# EAGLE schematic contra1579 (EAGLE 7.5.0)
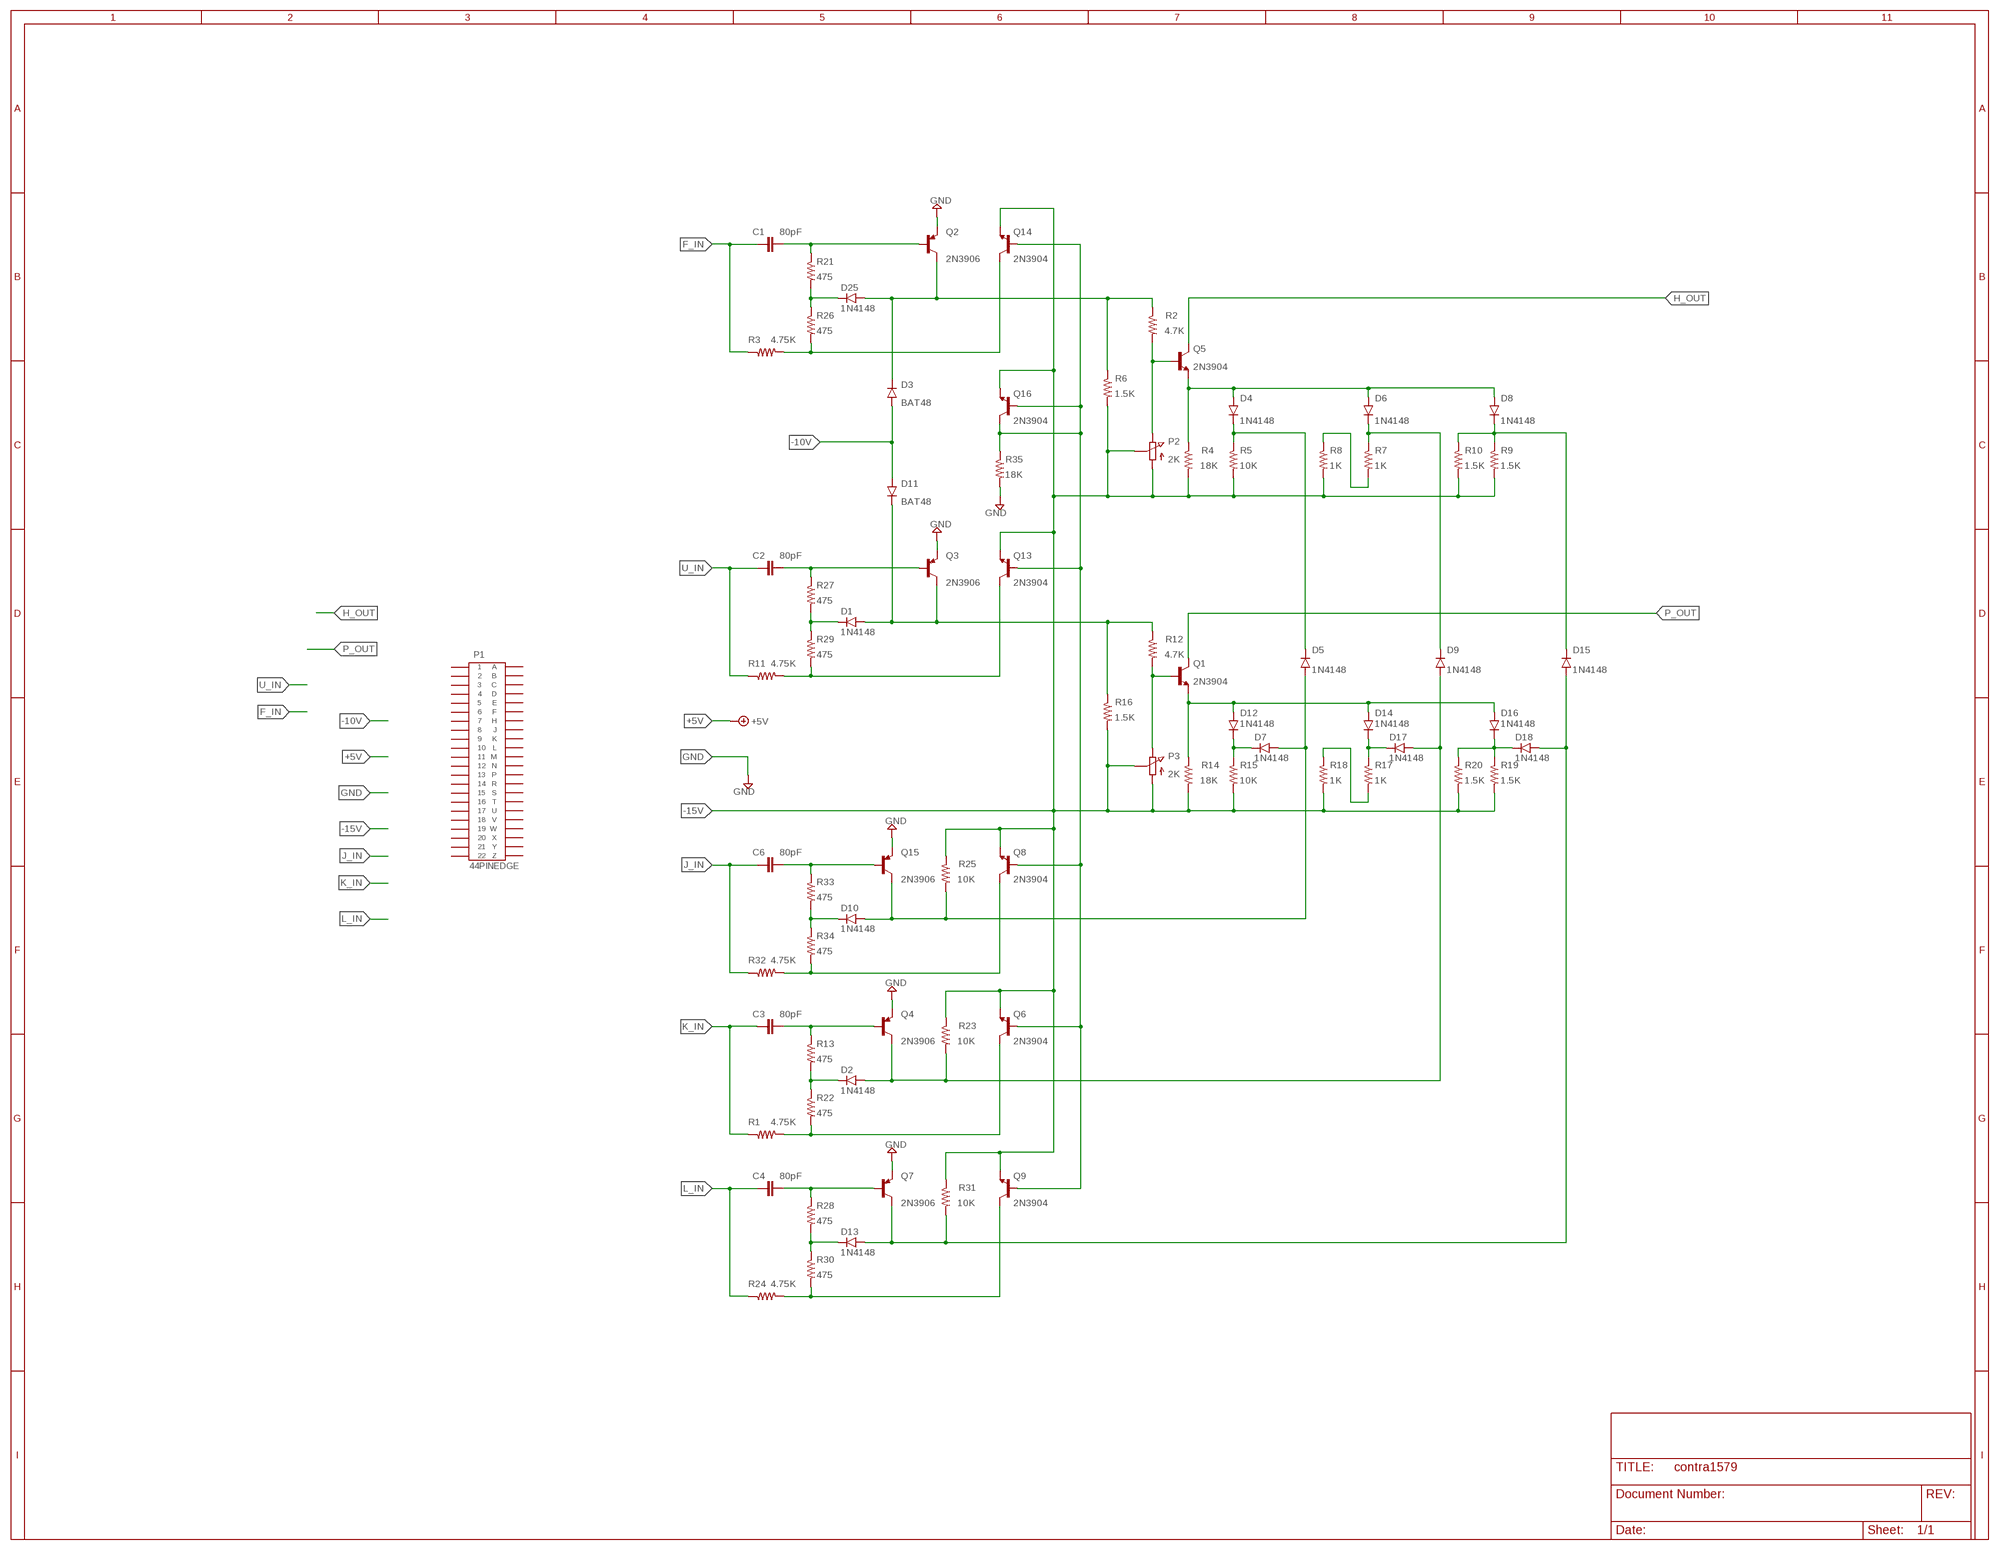
[diagram p0: schematic, sheet 1]

## Parts
C1  80pF  CAP1000PF  [5MM_TH]
C2  80pF  CAP1000PF  [5MM_TH]
C3  80pF  CAP1000PF  [5MM_TH]
C4  80pF  CAP1000PF  [5MM_TH]
C6  80pF  CAP1000PF  [5MM_TH]
D1  1N4148  [DO35-7]
D2  1N4148  [DO35-7]
D3  BAT48  1N4148  [DO35-7]
D4  1N4148  [DO35-7]
D5  1N4148  [DO35-7]
D6  1N4148  [DO35-7]
D7  1N4148  [DO35-7]
D8  1N4148  [DO35-7]
D9  1N4148  [DO35-7]
D10  1N4148  [DO35-7]
D11  BAT48  1N4148  [DO35-7]
D12  1N4148  [DO35-7]
D13  1N4148  [DO35-7]
D14  1N4148  [DO35-7]
D15  1N4148  [DO35-7]
D16  1N4148  [DO35-7]
D17  1N4148  [DO35-7]
D18  1N4148  [DO35-7]
D25  1N4148  [DO35-7]
P1  44PINEDGE  [44PINEDGE]
P2  2K  POT-3006P  [3006P]
P3  2K  POT-3006P  [3006P]
Q1  2N3904  [TO92]
Q2  2N3906  [TO92]
Q3  2N3906  [TO92]
Q4  2N3906  [TO92]
Q5  2N3904  [TO92]
Q6  2N3904  [TO92]
Q7  2N3906  [TO92]
Q8  2N3904  [TO92]
Q9  2N3904  [TO92]
Q13  2N3904  [TO92]
Q14  2N3904  [TO92]
Q15  2N3906  [TO92]
Q16  2N3904  [TO92]
R1  4.75K  R-1/4WATT  [0207/10]
R2  4.7K  R-1/4WATT  [0207/10]
R3  4.75K  R-1/4WATT  [0207/10]
R4  18K  R-1/4WATT  [0207/10]
R5  10K  R-1/4WATT  [0207/10]
R6  1.5K  R-1/4WATT  [0207/10]
R7  1K  R-1/4WATT  [0207/10]
R8  1K  R-1/4WATT  [0207/10]
R9  1.5K  R-1/4WATT  [0207/10]
R10  1.5K  R-1/4WATT  [0207/10]
R11  4.75K  R-1/4WATT  [0207/10]
R12  4.7K  R-1/4WATT  [0207/10]
R13  475  R-1/4WATT  [0207/10]
R14  18K  R-1/4WATT  [0207/10]
R15  10K  R-1/4WATT  [0207/10]
R16  1.5K  R-1/4WATT  [0207/10]
R17  1K  R-1/4WATT  [0207/10]
R18  1K  R-1/4WATT  [0207/10]
R19  1.5K  R-1/4WATT  [0207/10]
R20  1.5K  R-1/4WATT  [0207/10]
R21  475  R-1/4WATT  [0207/10]
R22  475  R-1/4WATT  [0207/10]
R23  10K  R-1/4WATT  [0207/10]
R24  4.75K  R-1/4WATT  [0207/10]
R25  10K  R-1/4WATT  [0207/10]
R26  475  R-1/4WATT  [0207/10]
R27  475  R-1/4WATT  [0207/10]
R28  475  R-1/4WATT  [0207/10]
R29  475  R-1/4WATT  [0207/10]
R30  475  R-1/4WATT  [0207/10]
R31  10K  R-1/4WATT  [0207/10]
R32  4.75K  R-1/4WATT  [0207/10]
R33  475  R-1/4WATT  [0207/10]
R34  475  R-1/4WATT  [0207/10]
R35  18K  R-1/4WATT  [0207/10]

## Nets
-10V: D3.A D11.A
-15V: P2.1(A) P2.2(S) P3.1(A) P3.2(S) Q6.3(E) Q8.3(E) Q9.3(E) Q13.3(E) Q14.3(E) Q16.3(E) R4.2 R5.2 R6.2 R8.2 R9.2 R10.2 R14.2 R15.2 R16.2 R18.2 R19.2 R20.2 R23.1 R25.1 R31.1
F_IN: C1.1 R3.1
GND: Q2.3(E) Q3.3(E) Q4.3(E) Q7.3(E) Q15.3(E) R35.2
H_OUT: Q5.1(C)
J_IN: C6.1 R32.1
K_IN: C3.1 R1.1
L_IN: C4.1 R24.1
N$1: C1.2 Q2.2(B) R21.1
N$2: Q14.1(C) R3.2 R26.2
N$3: C3.2 Q4.2(B) R13.1
N$4: P2.3(E) Q5.2(B) R2.2
N$5: D4.A D6.A D8.A Q5.3(E) R4.1
N$6: D4.C D5.C R5.1
N$7: R7.2 R8.1
N$8: Q6.1(C) R1.2 R22.2
N$9: D25.C R21.2 R26.1
N$10: D6.C D9.C R7.1
N$11: D8.C D15.C R9.1 R10.1
N$12: D2.C R13.2 R22.1
N$13: C4.2 Q7.2(B) R28.1
N$14: C2.2 Q3.2(B) R27.1
N$15: Q13.1(C) R11.2 R29.2
N$16: P3.3(E) Q1.2(B) R12.2
N$17: D12.A D14.A D16.A Q1.3(E) R14.1
N$18: D7.C D12.C R15.1
N$19: D14.C D17.C R17.1
N$20: R17.2 R18.1
N$21: D16.C D18.C R19.1 R20.1
N$22: Q9.1(C) R24.2 R30.2
N$23: D13.C R28.2 R30.1
N$25: D1.C R27.2 R29.1
N$30: C6.2 Q15.2(B) R33.1
N$31: Q8.1(C) R32.2 R34.2
N$32: D10.C R33.2 R34.1
N$33: Q6.2(B) Q8.2(B) Q9.2(B) Q13.2(B) Q14.2(B) Q16.1(C) Q16.2(B) R35.1
P_OUT: Q1.1(C)
U_IN: C2.1 R11.1
VREF: D3.C D25.A Q2.1(C) R2.1 R6.1
VREF1: D2.A D9.A D17.A Q4.1(C) R23.2
VREF2: D13.A D15.A D18.A Q7.1(C) R31.2
VREF3: D5.A D7.A D10.A Q15.1(C) R25.2
VREF5: D1.A D11.C Q3.1(C) R12.1 R16.1
Unconnected: P1.1 P1.2 P1.3 P1.4 P1.5 P1.6 P1.7 P1.8 P1.9 P1.10 P1.11 P1.12 P1.13 P1.14 P1.15 P1.16 P1.17 P1.18 P1.19 P1.20 P1.21 P1.22 P1.A P1.B P1.C P1.D P1.E P1.F P1.H P1.J P1.K P1.L P1.M P1.N P1.P P1.R P1.S P1.T P1.U P1.V P1.W P1.X P1.Y P1.Z

## Library data of the parts
C1-C4 C6 = keiths:CAP1000PF: Multilayer Ceramic Capacitors MLCC - Leaded 100V 1000pF X7R 10% RAD LS:5mm; PN: FA28X7R2A102KNU06
D1 D2 D4-D10 D12-D18 D25 = keiths:1N4148: High Conductance Fast Diode
D3 D11 = keiths:1N4148: High Conductance Fast Diode; PN: BAT48RL
P1 = keiths:44PINEDGE: 44 PIN EDGE CONNECTOR FOR PCB
P2 P3 = keiths:POT-3006P: 3006 - Trimpot® Trimming Potentiometer. Clockwise turn moves wiper to pin 3
Q1 Q5 Q6 Q8 Q9 Q13 Q14 Q16 = keiths:2N3904: NPN Transistor
Q2-Q4 Q7 Q15 = keiths:2N3906: PNP Transistor
R1-R35 = keiths:R-1/4WATT: Quarter watt through hole resistor.